# EAGLE design FollowMe (EAGLE 8.6.0)
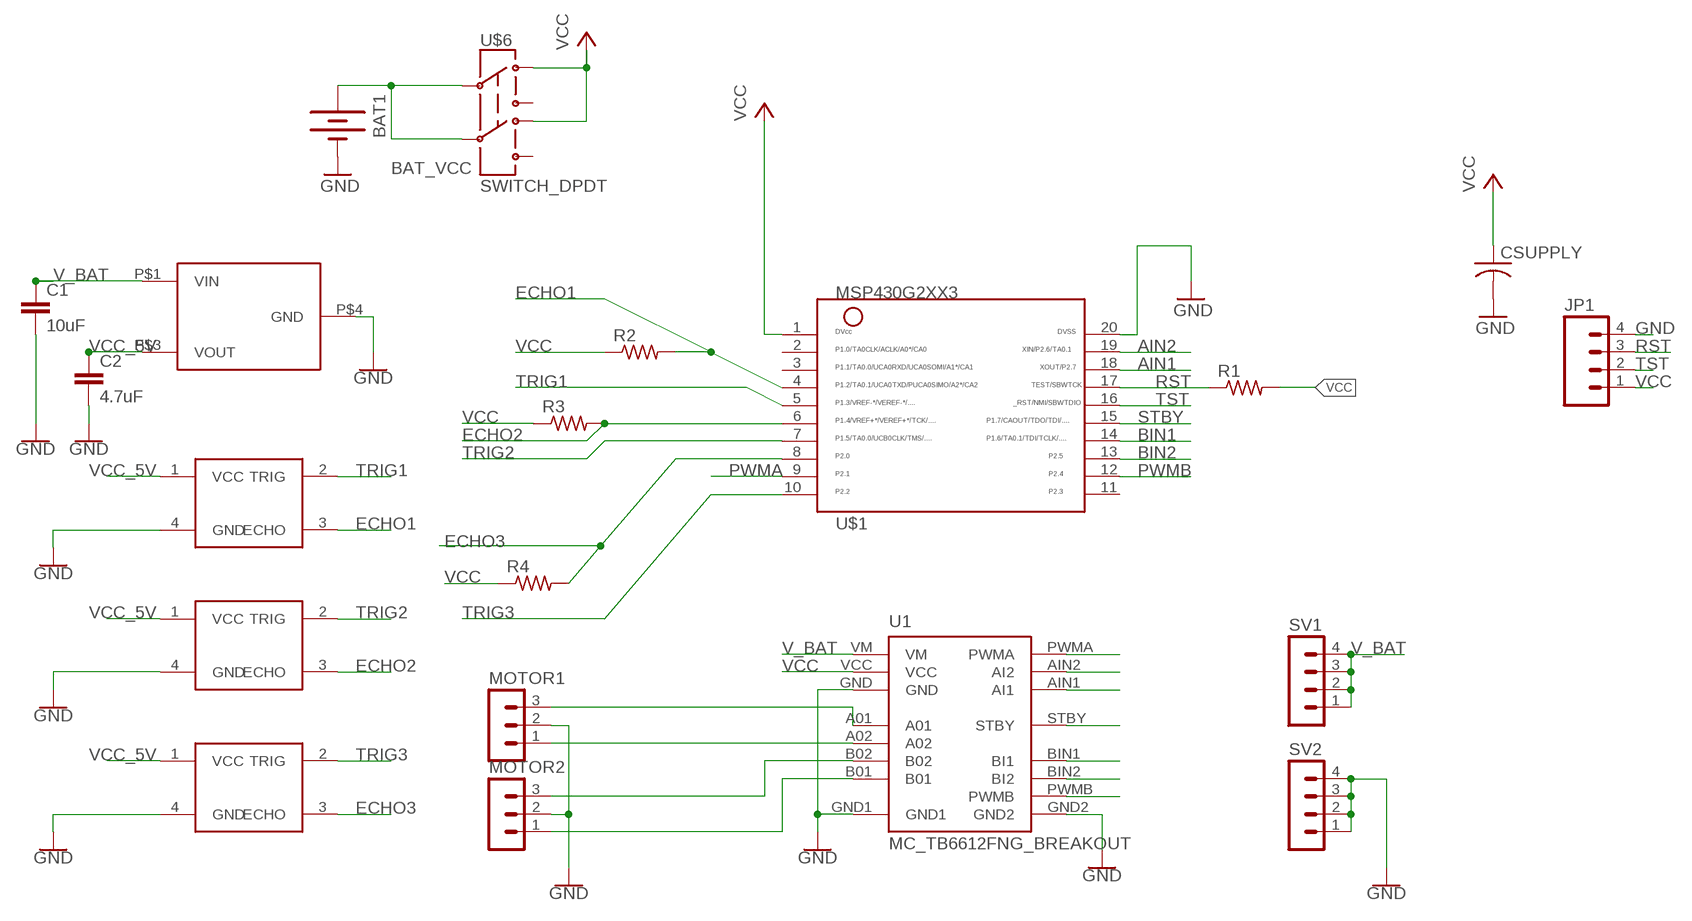
[diagram p0: schematic, sheet 1]

## Parts
BAT1  BATTERY  [BATTERY_PACK_2AA]
C1  10uF  10UF-1206-6.3V-20%  [1206]
C2  4.7uF  10UF-1206-6.3V-20%  [1206]
CSUPPLY  C-USC1206  [C1206]
JP1  M04LOCK  [1X04_LOCK]
MOTOR1  MA03-1  [MA03-1]
MOTOR2  MA03-1  [MA03-1]
R1  R-US_R1206  [R1206]
R2  R-US_R1206  [R1206]
R3  R-US_R1206  [R1206]
R4  R-US_R1206  [R1206]
SV1  MA04-1  [MA04-1]
SV2  MA04-1  [MA04-1]
U1  MC_TB6612FNG_BREAKOUT  [MC_TB6612FNG]
U$1  MSP430G2XX3TSSOP  [PW20]
U$2  LDO  [LDO]
U$3  ULTRASONIC  [ULTRASONIC]
U$4  ULTRASONIC  [ULTRASONIC]
U$5  ULTRASONIC  [ULTRASONIC]
U$6  SWITCH_DPDT  [JS_DPDT_TH]

## Nets
AIN1: U1.AIN1(AI1) U$1.18
AIN2: U1.AIN2(AI2) U$1.19
BAT_VCC: BAT1.3V(+) U$6.2 U$6.5
BIN1: U1.BIN1(BI1) U$1.14
BIN2: U1.BIN2(BI2) U$1.13
ECHO1: R2.2 U$1.4 U$3.3(ECHO)
ECHO2: R3.2 U$1.6 U$4.3(ECHO)
ECHO3: R4.2 U$1.8 U$5.3(ECHO)
GND: BAT1.GND(-) C1.2 C2.2 CSUPPLY.2 JP1.4 MOTOR1.2 MOTOR2.2 SV2.1 SV2.2 SV2.3 SV2.4 U1.GND U1.GND1 U1.GND2 U$1.20 U$2.P$4(GND) U$3.4(GND) U$4.4(GND) U$5.4(GND)
N$1: MOTOR1.3 U1.A01
N$2: MOTOR1.1 U1.A02
N$3: MOTOR2.3 U1.B02
N$4: MOTOR2.1 U1.B01
PWMA: U1.PWMA U$1.9
PWMB: U1.PWMB U$1.12
RST: JP1.3 R1.1 U$1.17
STBY: U1.STBY U$1.15
TRIG1: U$1.5 U$3.2(TRIG)
TRIG2: U$1.7 U$4.2(TRIG)
TRIG3: U$1.10 U$5.2(TRIG)
TST: JP1.2 U$1.16
V_BAT: C1.1 SV1.1 SV1.2 SV1.3 SV1.4 U1.VM U$2.P$1(VIN)
VCC: CSUPPLY.1 JP1.1 R1.2 R2.1 R3.1 R4.1 U1.VCC U$1.1 U$6.1 U$6.4
VCC_5V: C2.1 U$2.P$3(VOUT) U$3.1(VCC) U$4.1(VCC) U$5.1(VCC)
Unconnected: U$1.2 U$1.3 U$1.11 U$6.3 U$6.6

## Library data of the parts
BAT1 = ELEC327:BATTERY: Battery Holders Various common sizes : AA, AAA, 20mm coin cell and 12mm coin cell. 20MM_4LEGS, BATT-10373
C1 = SparkFun-Capacitors:10UF: 10.0µF ceramic capacitors A capacitor is a passive two-terminal electrical component used to store electrical energy temporarily in an electric field.; PROD_ID: CAP-10057
C2 = SparkFun-Capacitors:10UF: 10.0µF ceramic capacitors A capacitor is a passive two-terminal electrical component used to store electrical energy temporarily in an electric field.; PROD_ID: CAP-10057; VALUE: 10uF
CSUPPLY = rcl:C-US: CAPACITOR, American symbol
JP1 = SparkFun:M04: Header 4 Standard 4-pin 0.1" header. Use with straight break away headers (SKU : PRT-00116), right angle break away headers (PRT-00553), swiss pins (PRT-00743), machine pins (PRT-00117), and female headers (PRT-00115). Molex polarized connector foot print use with SKU : PRT-08231 with associated crimp pins and housings. 1MM SMD Version SKU: PRT-10208
MOTOR1 MOTOR2 = OEDK:MA03-1: PIN HEADER; OC_FARNELL: unknown; OC_NEWARK: unknown
R1-R4 = resistor:R-US_: RESISTOR, American symbol
SV1 SV2 = OEDK:MA04-1: PIN HEADER; OC_FARNELL: unknown; OC_NEWARK: unknown
U1 = final_project:MC_TB6612FNG_BREAKOUT
U$1 = ELEC327:MSP430G2XX3: MSP430G2XX3 PDIP (N) 20 Pin Package
U$2 = final_project:LDO
U$3-U$5 = final_project:ULTRASONIC
U$6 = ELEC327:SWITCH_DPDT

## Board
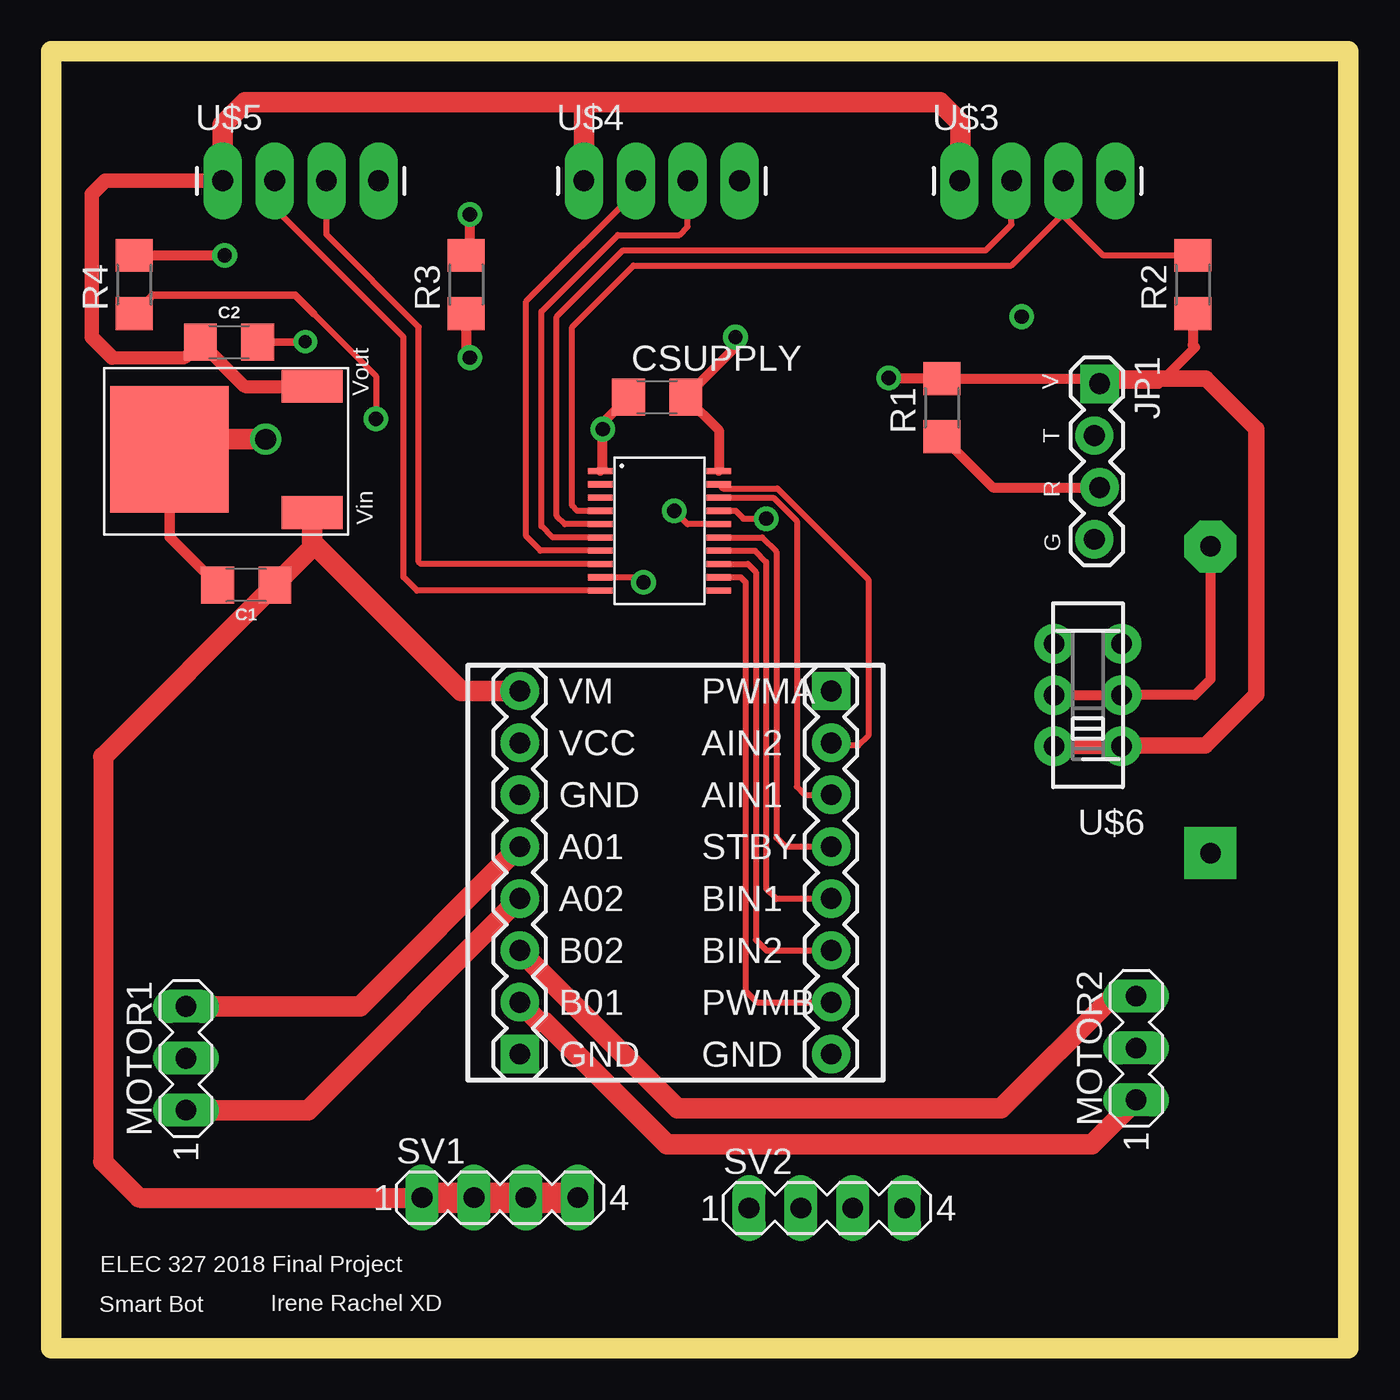
[diagram p1: board, top side]
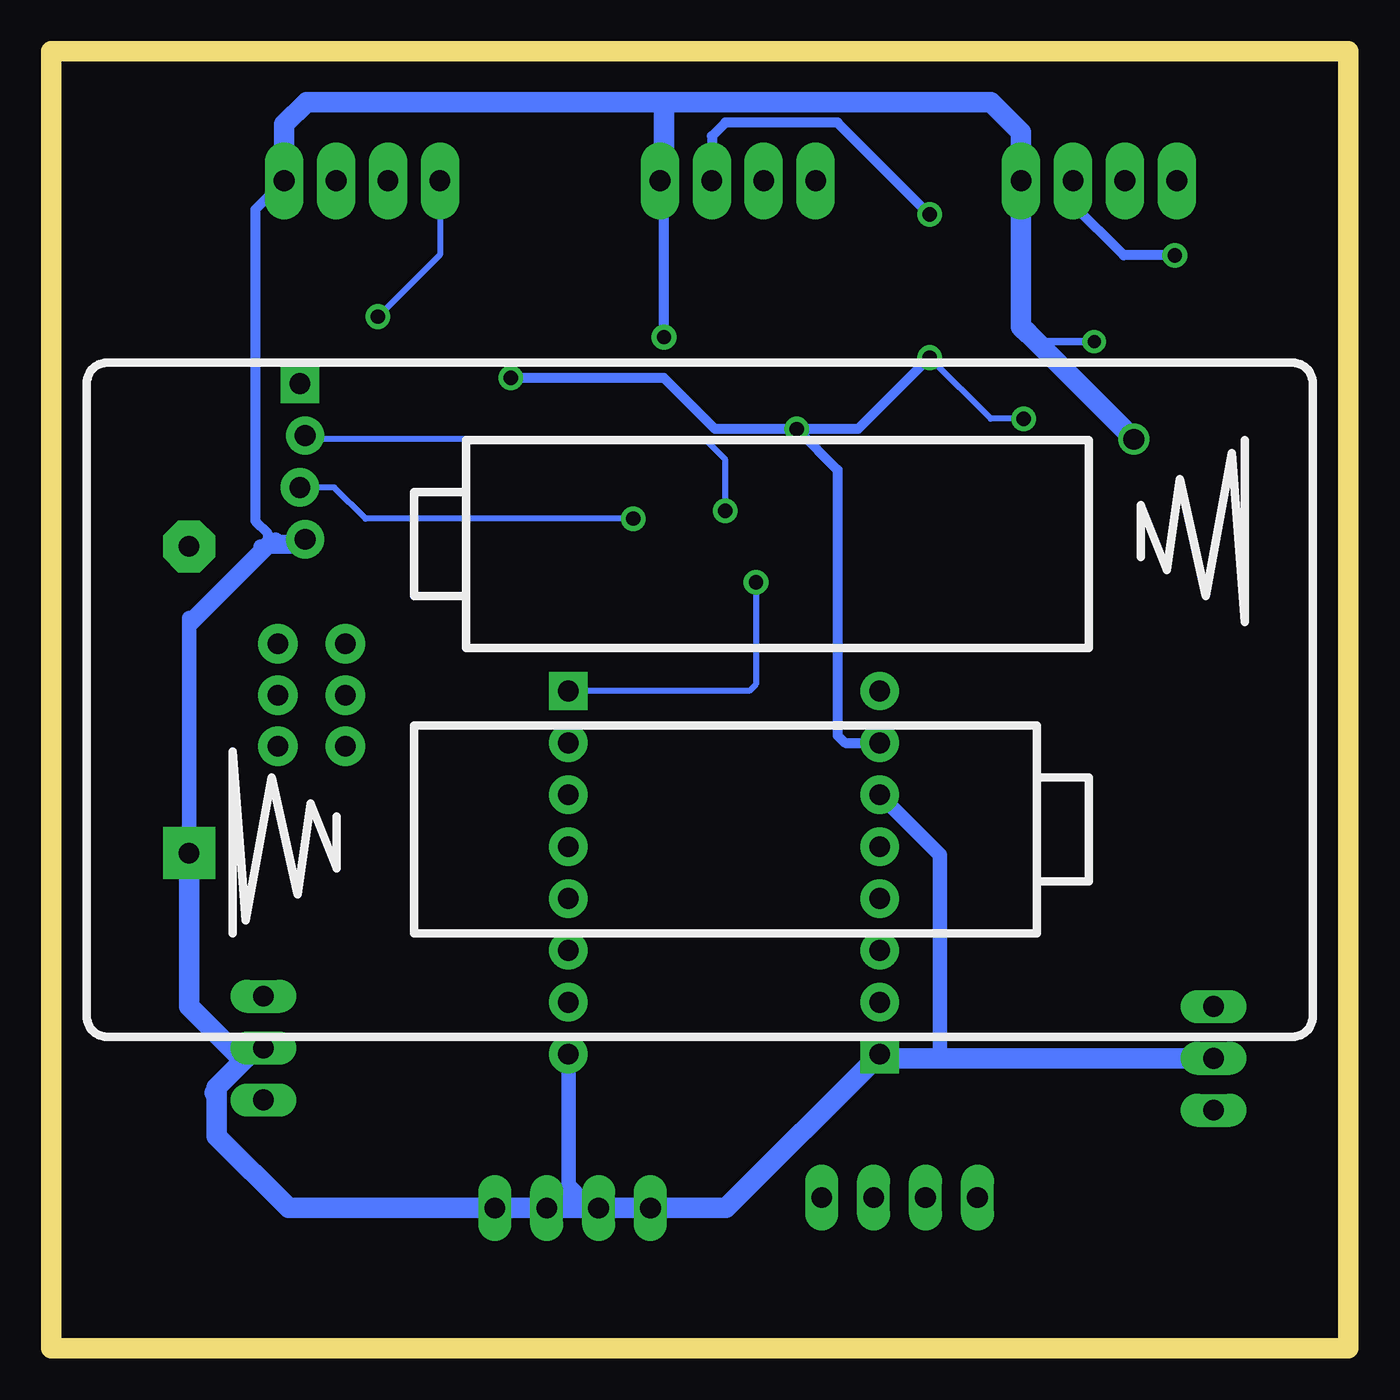
[diagram p2: board, bottom side, seen from below]

Size 63.5 x 63.5 mm. Coordinates in mm from the lower left corner, seen from the top.
Outline: 0,63.5 63.5,63.5 63.5,0 0,0 0,63.5
Copper layers (1*16): Top 0.035mm / dielectric 1.5mm / Bottom 0.035mm
Design rules "AdvancedCircuitsBarebones": minimum track width 6mil, minimum drill 20mil, track to track 6mil, track to pad 6mil, pad to pad 6mil, via to via 6mil, smd to smd 6mil, copper to edge 10mil, drill to drill 6mil, minimum pad ring 12mil, minimum via ring 10mil, stop-mask expansion 4mil, vias tented up to drill 25mil, thermal gap 10mil

### Footprints (pad centres in the part's own frame; a part is rotated, then mirrored left to right if it is on the bottom)
BATTERY_PACK_2AA = drill 1 pad 2.54 octagon: 3V 7.5,25 | drill 1 pad 2.54 square: GND -7.5,25
1206 = smd 1.6 x 1.8: 1 -1.4,0; 2 1.4,0
C1206 = smd 1.6 x 1.8: 1 -1.4,0; 2 1.4,0
1X04_LOCK = drill 1.016 pad 1.88 square: 1 0,0.127 | drill 1.016 pad 1.88: 2 2.54,-0.127; 3 5.08,0.127; 4 7.62,-0.127
MA03-1 = drill 1.016 long: 1 -2.54,0; 2 0,0; 3 2.54,0
R1206 = smd 1.6 x 1.803: 1 -1.422,0; 2 1.422,0
MA04-1 = drill 1.016 long: 1 -3.81,0; 2 -1.27,0; 3 1.27,0; 4 3.81,0
MC_TB6612FNG = drill 1.016 pad 1.88: A01 2.54,11.43; A02 2.54,8.89; AIN1 17.78,13.97; AIN2 17.78,16.51; B01 2.54,3.81; B02 2.54,6.35; BIN1 17.78,8.89; BIN2 17.78,6.35; GND 2.54,13.97; GND2 17.78,1.27; PWMB 17.78,3.81; STBY 17.78,11.43; VCC 2.54,16.51; VM 2.54,19.05 | drill 1.016 pad 1.88 square: GND1 2.54,1.27; PWMA 17.78,19.05
PW20 = smd 0.3 x 1.2: 1 -2.925,-2.9; 2 -2.275,-2.9; 3 -1.625,-2.9; 4 -0.975,-2.9; 5 -0.325,-2.9; 6 0.325,-2.9; 7 0.975,-2.9; 8 1.625,-2.9; 9 2.275,-2.9; 10 2.925,-2.9; 11 2.925,2.9; 12 2.275,2.9; 13 1.625,2.9; 14 0.975,2.9; 15 0.325,2.9; 16 -0.325,2.9; 17 -0.975,2.9; 18 -1.625,2.9; 19 -2.275,2.9; 20 -2.925,2.9
LDO = smd 2.997 x 1.6: P$1 -1.499,0.813; P$3 -1.499,6.985 | smd 5.791 x 6.198: P$4 -8.484,3.912
ULTRASONIC = drill 1.016 pad 1.88 long: 1 0,0; 2 2.54,0; 3 5.08,0; 4 7.62,0
JS_DPDT_TH = drill 1 pad 1.93: 1 -2.5,-1.65; 2 0,-1.65; 3 2.5,-1.65; 4 -2.5,1.65; 5 0,1.65; 6 2.5,1.65

### Placement (x,y rotation side)
BAT1  31.75,31.75 90 bottom
C1  9.55,37.36 180 top
C2  8.71,49.25 0 top
CSUPPLY  29.66,46.56 0 top
JP1  51.19,47.22 270 top
MOTOR1  6.6,14.2 90 top
MOTOR2  53.11,14.7 90 top
R1  43.6,46.05 90 top
R2  55.88,52.07 90 top
R3  20.32,52.07 90 top
R4  4.06,52.07 90 top
SV1  21.97,7.38 0 top
SV2  37.97,6.87 0 top
U1  20.4,13.13 0 top
U$1  29.78,40.02 270 top
U$2  14.28,40.1 0 top
U$3  44.47,57.15 0 top
U$4  26.08,57.15 0 top
U$5  8.4,57.15 0 top
U$6  50.75,31.98 90 top

### Tracks (layer width: path | path; a pad name or v marks a point on that pad's centre or on a via)
AIN1
  Top 0.3: U$1.18 35.35,41.65 36.5,40.5 36.5,27.5 36.9,27.1 U1.AIN1
AIN2
  Top 0.3: U$1.19 32.88,42.1 35.54,42.1 40,37.64 40,30 39.5,29.5 38.32,29.5 U1.AIN2
BAT_VCC
  Top 0.5: BAT1.3V 56.75,32.75 55.98,31.98 U$6.2 U$6.5
BIN1
  Top 0.3: U$1.14 34.45,39.05 35,38.5 35,22.5 35.5,22 35.52,22.02 U1.BIN1
BIN2
  Top 0.3: U$1.13 34.1,38.4 34.5,38 34.5,20 35.02,19.48 U1.BIN2
ECHO1
  Top 0.3: U$1.4 25.75,40.99 25.5,41.25 25.5,50 28.5,53 47,53 49.55,55.55 | 49.55,55.55 49.55,57 U$3.3 | R2.2 51.51,53.49 49.55,55.45 49.55,55.55
ECHO2  (via drill 0.7)
  Top 0.3: U$1.6 24.55,39.7 24,40.25 24,50.75 27.75,54.5 30.75,54.5 31.16,54.91 U$4.3
  Top 0.5: R3.2 20.5,53.67 v20.5,55.5
  Bottom 0.5: v20.5,55.5 25,60 30.5,60 31.16,59.34 U$4.3
ECHO3  (via drill 0.7)
  Top 0.3: U$1.8 18.11,38.4 18,38.5 18,50 13.48,54.52 U$5.3
  Top 0.5: R4.2 5.09,53.5 v8.5,53.5
  Bottom 0.5: v8.5,53.5 11,53.5 13.5,56 13.48,56.02 U$5.3
GND  (via drill 0.64, 0.7, 1.02)
  Top 0.356: C2.2 12.42,49.25 v12.45,49.28
  Top 0.5: U$1.20 32.68,44.94 CSUPPLY.2 33.5,49 v33.5,49.5
  Top 0.508: U$2.P$4 5.8,39.72 C1.2
  Top 1: 5.5,44.5 v10.5,44.5
  Top 1.5: U$2.P$4 5.8,44.2 5.5,44.5
  Bottom 0.356: v12.45,49.28 15.28,49.28 15.64,49.64
  Bottom 0.5: v33.5,49.5 33.5,56.95 U$4.4 | 52.9,39.6 52.5,39.6 JP1.4 | 56.75,35.75 53.25,39.25 52.9,39.6 | U$3.4 53.5,55.74 53.5,40.5 52.9,39.9 52.9,39.6
  Bottom 0.7: SV2.3 38.18,7.93 U1.GND2 | BAT1.GND 56.75,35.35 | 56.75,35.35 56.75,35.75 | JP1.4 51.41,39.25 53.25,39.25 | 52.5,39.6 56.75,35.35 | U1.GND 20,24.16 20,14.2
  Bottom 0.8: SV2.2 37.5,6.87 37.5,7.25 38.18,7.93
  Bottom 1: 33.5,61 17.5,61 16.02,59.52 U$5.4 16.02,50.02 15.64,49.64 v10.5,44.5 | 33.5,61 51,61 52.09,59.91 U$3.4 | U$4.4 33.5,57.35 33.5,61 | BAT1.GND 56.75,16.75 54.5,14.5 54.3,14.7 MOTOR2.2 53.45,14.7 55.39,12.77 55.39,12.61 55.5,12.5 55.39,12.39 55.39,10.39 51.87,6.87 SV2.4 37.5,6.87 SV2.1 30.47,6.87 U1.GND1 22.74,14.2 20,14.2 MOTOR1.2
N$1
  Top 1: U1.A01 15.12,16.74 MOTOR1.3
N$2
  Top 1: U1.A02 12.58,11.66 MOTOR1.1
N$3
  Top 1: U1.B02 30.67,11.75 46.5,11.75 51.99,17.24 MOTOR2.3
N$4
  Top 1: U1.B01 23.89,15.99 24.15,15.99 30.14,10 50.95,10 MOTOR2.1
PWMA  (via drill 0.7)
  Top 0.3: U$1.9 28.75,37.74 v29,37.5
  Bottom 0.3: v29,37.5 29,32.5 29.32,32.18 U1.PWMA
PWMB
  Top 0.3: U$1.12 33.76,37.74 34,37.5 34,17.5 34.56,16.94 U1.PWMB
RST  (via drill 0.7)
  Top 0.3: U$1.17 33.5,41 33.89,40.61 v35,40.61
  Top 0.5: R1.1 46.09,42.14 JP1.3
  Bottom 0.3: JP1.3 49.64,42.14 48.11,40.61 v35,40.61
STBY
  Top 0.3: U1.STBY 35.94,24.56 35.5,25 35.5,39 34.8,39.7 U$1.15
TRIG1
  Top 0.3: U$1.5 25.16,40.34 24.75,40.75 24.75,50.5 28,53.75 45.75,53.75 47.01,55.01 U$3.2
TRIG2
  Top 0.3: U$1.7 23.95,39.05 23.25,39.75 23.25,51.25 28.62,56.62 U$4.2
TRIG3
  Top 0.3: U$1.10 17.91,37.09 17.25,37.75 17.25,49.5 10.94,55.81 U$5.2
TST  (via drill 0.7)
  Top 0.3: U$1.16 31.16,40.34 v30.5,41
  Bottom 0.3: v30.5,41 30.5,43.5 31.5,44.5 50.88,44.5 JP1.2
V_BAT
  Top 0.7: 23.5,7.38 SV1.3 SV1.2
  Top 0.991: U$2.P$1 12.78,39.19 C1.1 2.54,28.95 2.54,9.14 4.3,7.38 SV1.1
  Top 1: U$2.P$1 12.78,39.47 20.07,32.18 U1.VM
  Top 1.5: SV1.1 23.5,7.38 SV1.4
VCC  (via drill 0.7)
  Top 0.3: v15.9,45.5 15.9,47.6 12.85,50.65
  Top 0.356: 12.85,50.65 11.94,51.56 4.98,51.56 R4.1
  Top 0.5: CSUPPLY.1 27,45.3 v27,45 27,43.06 U$1.1 | v41,47.5 43.57,47.5 R1.2 51.06,47.47 JP1.1 54.22,47.22 56,49 55.88,49.12 R2.1 | R3.1 20.32,48.68 v20.5,48.5
  Top 0.8: U$6.4 U$6.1 52.42,29.5 56.5,29.5 59,32 59,45 56.53,47.47 51.06,47.47
  Bottom 0.3: v15.9,45.5 17.5,45.5 v20.5,48.5
  Bottom 0.5: v27,45 25,43 25,30 24.64,29.64 U1.VCC | v27,45 31,45 33.5,47.5 v41,47.5 | v20.5,48.5 24,45 v27,45
VCC_5V  (via drill 0.7)
  Top 0.3: v47.5,50.5 47.65,50.65
  Top 0.5: U$2.P$3 13.09,47.09
  Top 0.635: 3,48.5 6.56,48.5 C2.1 9.48,47.09 U$2.P$3
  Top 0.7: 3,48.5 2,49.5 2,56.5 2.65,57.15 U$5.1
  Top 1: U$5.1 8.4,59.9 9.5,61 26,61 | 26,61 43.5,61 44.5,60 44.5,57.18 U$3.1 | U$4.1 26.08,60.92 26,61
  Bottom 0.3: U$3.1 44.47,53.53 v47.5,50.5

### Text on the board
tPlace: Vout | V | T | Vin | R | G | ELEC 327 2018 Final Project | Smart Bot | Irene Rachel XD